# EAGLE board IGVC Controller v1.9 (EAGLE 6.4), part 1 of 2
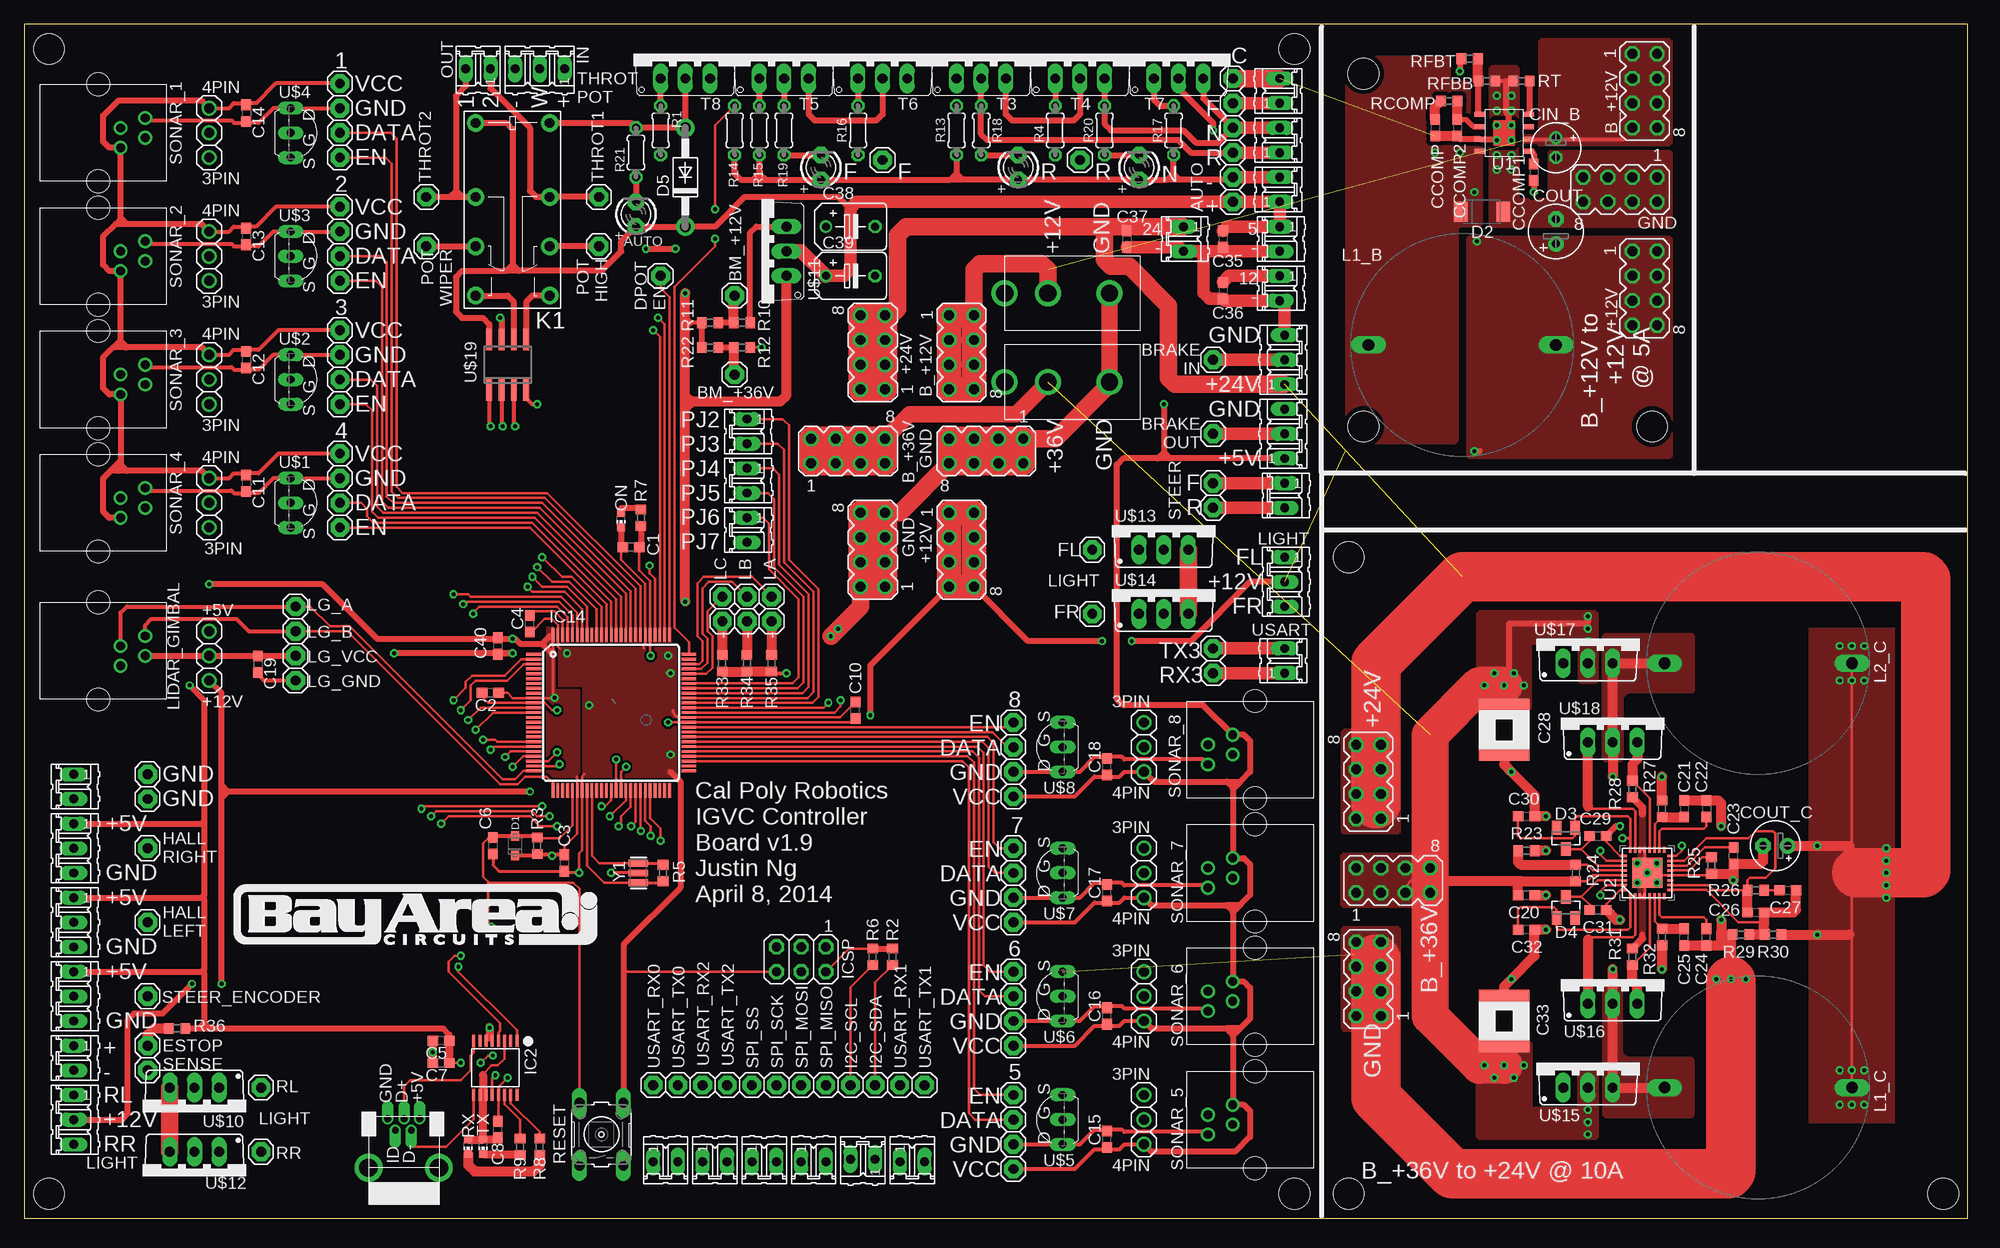
[diagram p7: board, top side]
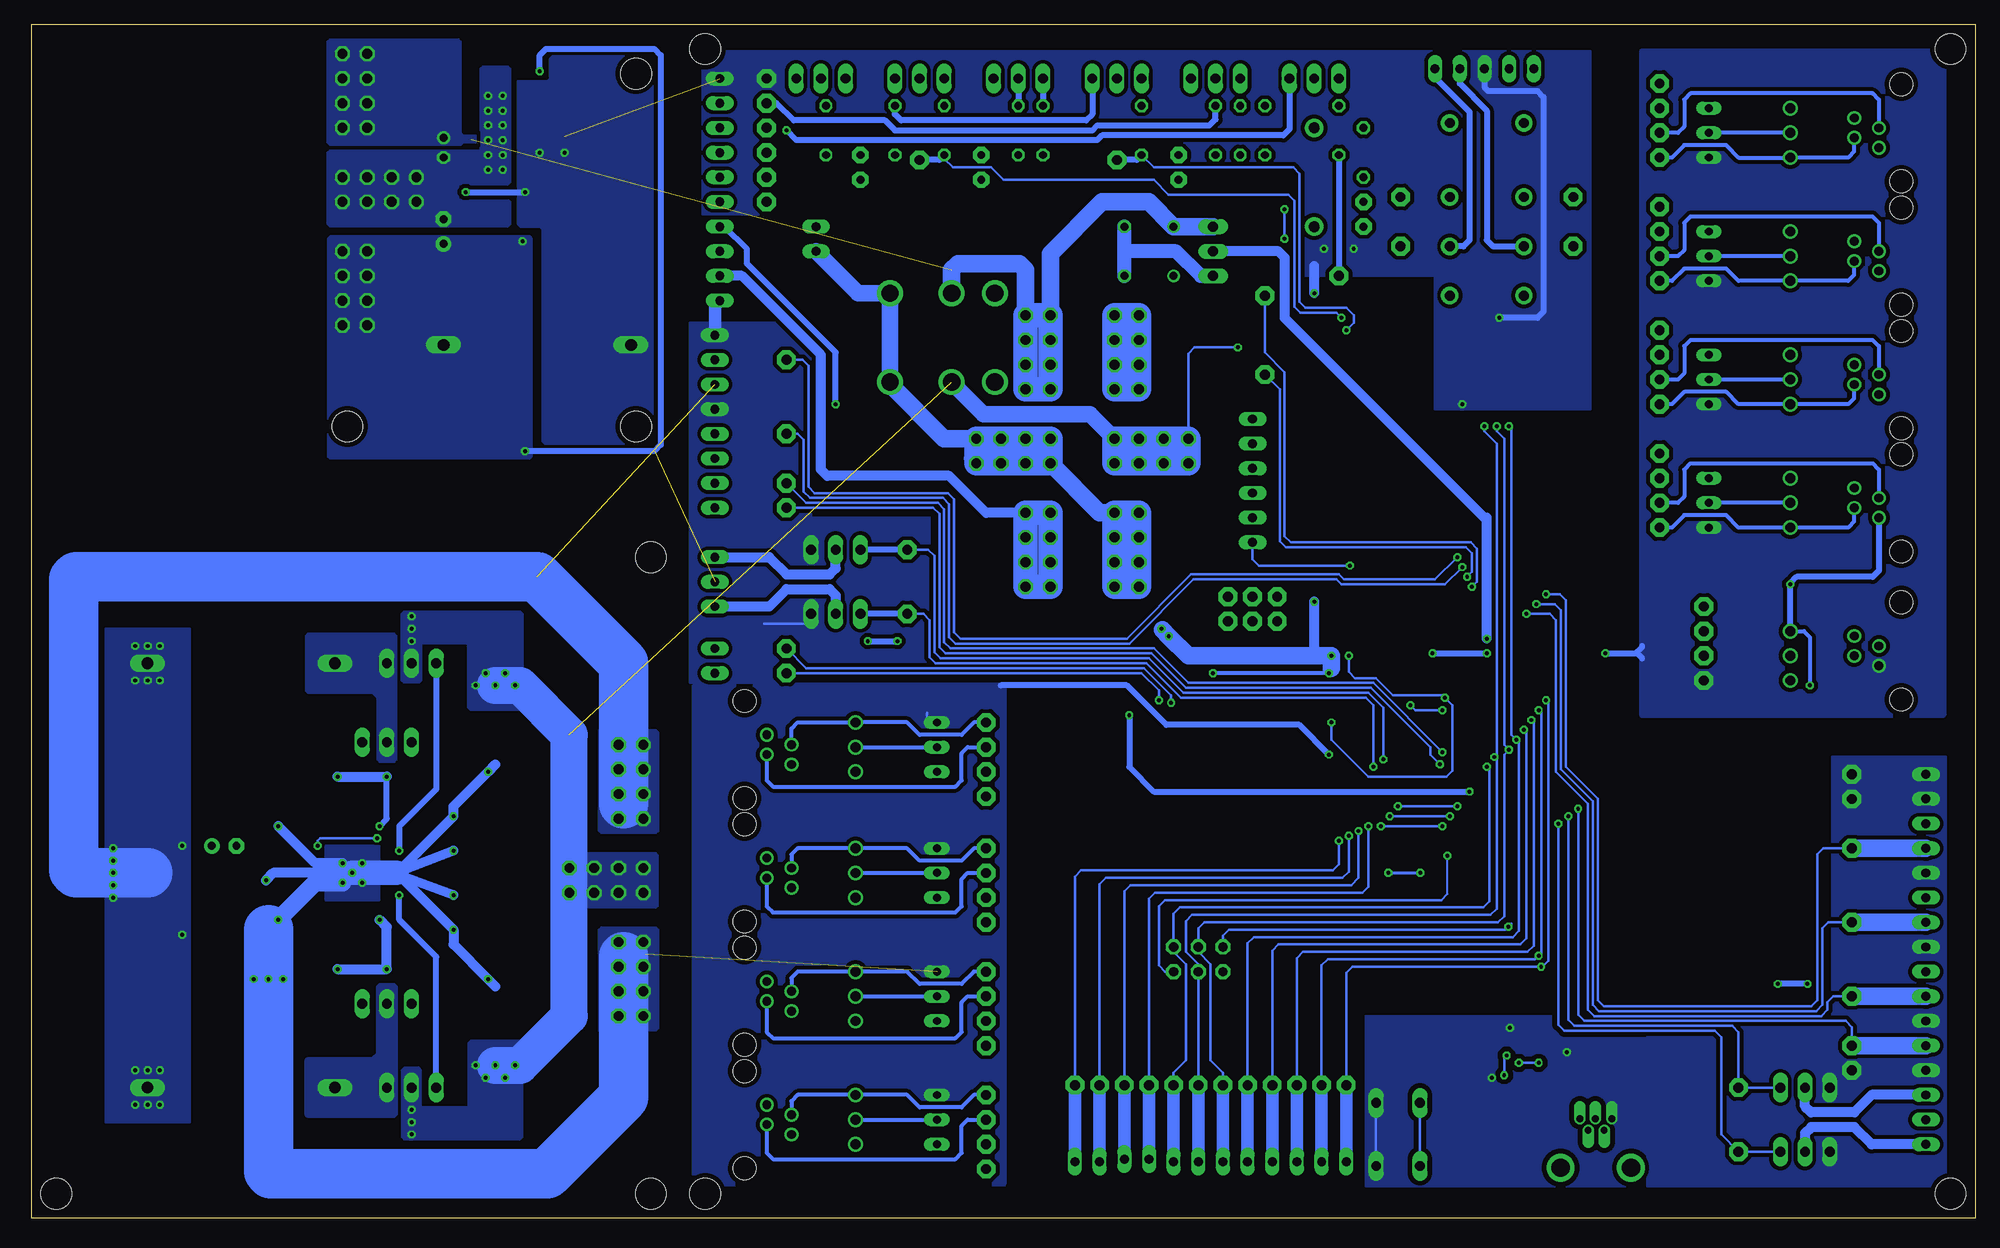
[diagram p8: board, bottom side, seen from below]

Size 200.15 x 122.94 mm. Coordinates in mm from the lower left corner, seen from the top.
Outline: 0,0 200.15,0 200.15,122.94 0,122.94 0,0
Copper layers (1*16): Top 0.035mm / dielectric 1.5mm / Bottom 0.035mm
Design rules "bayareacircuits *": minimum track width 8mil, minimum drill 15mil, track to track 8mil, track to pad 8mil, pad to pad 8mil, via to via 8mil, smd to smd 0mil, copper to edge 20mil, drill to drill 16mil, minimum pad ring 10mil, minimum via ring 8mil, stop-mask expansion 4mil, vias tented up to drill 0mil, thermal gap 10mil
Net classes: 0 default: width 0.203 mm, drill 0.406 mm, clearance 0.102 mm; 1 power: width 0.203 mm, drill 0.406 mm, clearance 0.203 mm; 2 gnd: width 0.203 mm, drill 0.406 mm, clearance 0.203 mm; 3 power usb: width 0.508 mm, drill 0.406 mm, clearance 0.203 mm
Holes 3.17 mm at 2.54,2.54 130.81,120.4 2.54,120.4 130.81,2.54 137.92,81.53 167.64,81.53 137.92,117.86 136.4,68.07 136.4,2.54 197.61,2.54

## Footprints (pad centres in the part's own frame; a part is rotated, then mirrored left to right if it is on the bottom)
02P = drill 0.914 long: 1 -1.27,0; 2 1.27,0
1X01 = drill 1.016 pad 1.93 octagon: 1 0,0
432550059 = drill 1.778: 1 -2.54,0; 2 3.81,0; 3 -6.985,0
03P = drill 0.914 long: 1 -2.54,0; 2 0,0; 3 2.54,0
C0603 = smd 1.1 x 1: 1 -0.85,0; 2 0.85,0
5750 = smd 1.2 x 5.2: P$1 -2.6,0; P$2 2.6,0
B45181B = drill 0.813: + -2.54,0 | drill 0.813 octagon: - 2.54,0
E2-5 = drill 0.813 pad 1.27: + -1.016,0 | drill 0.813 pad 1.27 octagon: - 1.016,0
E2,5-6 = drill 0.813 pad 1.6: + -1.27,0 | drill 0.813 pad 1.6 octagon: - 1.27,0
E2,5-5 = drill 0.813 pad 1.6: + -1.27,0 | drill 0.813 pad 1.6 octagon: - 1.27,0
SOD-323F = smd 1 x 0.8: A -1,0; C 1,0
SOD-128 = smd 1.4 x 2.1: A -2.2,0; C 2.2,0
SOT23 = smd 1 x 1.4: 1 -0.95,-1.1; 2 0.95,-1.1; 3 0,1.1
DO41-10 = drill 1.118 pad 1.93: A 5.08,0; C -5.08,0
SSOP-16-FTDI = smd 0.32 x 1.26: 1 -2.223,-2.779; 2 -1.588,-2.779; 3 -0.953,-2.779; 4 -0.318,-2.779; 5 0.317,-2.779; 6 0.952,-2.779; 7 1.587,-2.779; 8 2.222,-2.779; 9 2.222,2.779; 10 1.587,2.779; 11 0.952,2.779; 12 0.317,2.779; 13 -0.318,2.779; 14 -0.953,2.779; 15 -1.588,2.779; 16 -2.223,2.779
TQFP100 = smd 1.5 x 0.29: 1 -8,6; 2 -8,5.5; 3 -8,5; 4 -8,4.5; 5 -8,4; 6 -8,3.5; 7 -8,3; 8 -8,2.5; 9 -8,2; 10 -8,1.5; 11 -8,1; 12 -8,0.5; 13 -8,0; 14 -8,-0.5; 15 -8,-1; 16 -8,-1.5; 17 -8,-2; 18 -8,-2.5; 19 -8,-3; 20 -8,-3.5; 21 -8,-4; 22 -8,-4.5; 23 -8,-5; 24 -8,-5.5; 25 -8,-6; 51 8,-6; 52 8,-5.5; 53 8,-5; 54 8,-4.5; 55 8,-4; 56 8,-3.5; 57 8,-3; 58 8,-2.5; 59 8,-2; 60 8,-1.5; 61 8,-1; 62 8,-0.5; 63 8,0; 64 8,0.5; 65 8,1; 66 8,1.5; 67 8,2; 68 8,2.5; 69 8,3; 70 8,3.5; 71 8,4; 72 8,4.5; 73 8,5; 74 8,5.5; 75 8,6 | smd 0.29 x 1.5: 26 -6,-8; 27 -5.5,-8; 28 -5,-8; 29 -4.5,-8; 30 -4,-8; 31 -3.5,-8; 32 -3,-8; 33 -2.5,-8; 34 -2,-8; 35 -1.5,-8; 36 -1,-8; 37 -0.5,-8; 38 0,-8; 39 0.5,-8; 40 1,-8; 41 1.5,-8; 42 2,-8; 43 2.5,-8; 44 3,-8; 45 3.5,-8; 46 4,-8; 47 4.5,-8; 48 5,-8; 49 5.5,-8; 50 6,-8; 76 6,8; 77 5.5,8; 78 5,8; 79 4.5,8; 80 4,8; 81 3.5,8; 82 3,8; 83 2.5,8; 84 2,8; 85 1.5,8; 86 1,8; 87 0.5,8; 88 0,8; 89 -0.5,8; 90 -1,8; 91 -1.5,8; 92 -2,8; 93 -2.5,8; 94 -3,8; 95 -3.5,8; 96 -4,8; 97 -4.5,8; 98 -5,8; 99 -5.5,8; 100 -6,8
2X03 = drill 0.95 pad 1.55 octagon: 1 -2.54,-1.27; 2 -2.54,1.27; 3 0,-1.27; 4 0,1.27; 5 2.54,-1.27; 6 2.54,1.27
G5V-2 = drill 1 pad 1.8: 1 -8.89,-3.81; 4 -1.27,-3.81; 6 3.81,-3.81; 8 8.89,-3.81; 9 8.89,3.81; 11 3.81,3.81; 13 -1.27,3.81; 16 -8.89,3.81
TOROID = drill 1.2 long: P$1 -9.652,0; P$2 9.652,0
LED3MM = drill 0.813 pad 1.676 octagon: A -1.27,0; K 1.27,0
615004143821 = drill 0.9: 1 1.53,2.3; 2 0.51,4.84; 3 -0.51,2.3; 4 -1.53,4.84 | hole 2.36: -5,0; 5,0
1X03 = drill 1.016: 1 -2.54,0; 2 0,0; 3 2.54,0
CHIP-LED0603 = smd 0.8 x 0.8: A 0,-0.75; C 0,0.75
0204/5 = drill 0.813 octagon: 1 -2.54,0; 2 2.54,0
R0603 = smd 1 x 1.1: 1 -0.85,0; 2 0.85,0
B3F-10XX = drill 1.016 long: 1 -3.251,2.261; 2 3.251,2.261; 3 -3.251,-2.261; 4 3.251,-2.261
MA04-2 = drill 1.016 octagon: 1 -3.81,-1.27; 2 -3.81,1.27; 3 -1.27,-1.27; 4 -1.27,1.27; 5 1.27,-1.27; 6 1.27,1.27; 7 3.81,-1.27; 8 3.81,1.27
TO220V = drill 1.016 long: 1 -2.54,-2.54; 2 0,-2.54; 3 2.54,-2.54
R-PDSO-G8 = smd 1.1 x 0.51: BOOT -2.5,1.4; COMP 2.5,-1.13; EN -2.5,-1.13; FB 2.5,-2.4; GND 2.5,0.13; RT_CLK -2.5,-2.4; SW 2.5,1.4; VIN -2.5,0.13
SQA32A = smd 0.61 x 0.254: 1 -2.388,1.753; 2 -2.388,1.245; 3 -2.388,0.762; 4 -2.388,0.254; 5 -2.388,-0.254; 6 -2.388,-0.762; 7 -2.388,-1.245; 8 -2.388,-1.753; 17 2.388,-1.753; 18 2.388,-1.245; 19 2.388,-0.762; 20 2.388,-0.254; 21 2.388,0.254; 22 2.388,0.762; 23 2.388,1.245; 24 2.388,1.753 | smd 0.254 x 0.61: 9 -1.753,-2.388; 10 -1.245,-2.388; 11 -0.762,-2.388; 12 -0.254,-2.388; 13 0.254,-2.388; 14 0.762,-2.388; 15 1.245,-2.388; 16 1.753,-2.388; 25 1.753,2.388; 26 1.245,2.388; 27 0.762,2.388; 28 0.254,2.388; 29 -0.254,2.388; 30 -0.762,2.388; 31 -1.245,2.388; 32 -1.753,2.388 | smd 3.099 x 3.099: 33 0,0
TO92-DGS = drill 0.813 long: D -2.54,0; G 0,0; S 2.54,0
USB-MINI-B = drill 0.7 pad 0.813 offset: +5V 3.4,-1.85; D+ 3.4,-0.25; D- 2.2,-1; GND 3.4,1.45; ID 2.2,0.65 | drill 1.9: P$1 -1.65,-3.85; P$7 -1.65,3.4
TO220-GDS = drill 1.016 long: D 0,-2.54; G -2.54,-2.54; S 2.54,-2.54
SO8 = smd 0.6 x 2.2: 1 -1.905,-2.6; 2 -0.635,-2.6; 3 0.635,-2.6; 4 1.905,-2.6; 5 1.905,2.6; 6 0.635,2.6; 7 -0.635,2.6; 8 -1.905,2.6
RESONATOR = smd 0.7 x 2: 1 -1,0; 2 0,0; 3 1,0

## Placement (x,y rotation side)
+5V  [02P]  129.29,100.84 270 top
+12V  [02P]  129.29,95.76 270 top
+24V  [02P]  119.38,100.84 270 top
AM_TOGGLE  [02P]  129.29,105.92 90 top
AMTOG+  [1X01]  124.46,104.65 0 top
AMTOG-  [1X01]  124.46,107.19 0 top
B_+12V  432550059  [432550059]  107.95,95.25 0 top
B_+36V  432550059  [432550059]  107.95,86.11 0 top
BM_+12V  [1X01]  73.15,95 0 top
BM_+36V  [1X01]  73.15,86.87 0 top
BRAKE_IN  [1X01]  122.43,88.39 180 top
BRAKE_OUT  [1X01]  122.43,80.77 180 top
BRAKES_IN  [03P]  129.79,88.39 90 top
BRAKES_OUT  [03P]  129.79,80.77 90 top
C1  0.1uF  [C0603]  62.48,69.09 180 top
C2  0.1uF  [C0603]  48.01,54.1 180 top
C3  0.1uF  [C0603]  55.63,36.58 270 top
C4  0.1uF  [C0603]  52.07,61.21 90 top
C5  4.7uF  [C0603]  42.93,18.29 180 top
C6  22pF  [C0603]  48.26,38.35 270 top
C7  0.1uF  [C0603]  42.93,16 180 top
C8  0.1uF  [C0603]  48.77,9.14 90 top
C10  0.1uF  [C0603]  85.6,52.32 90 top
C11  0.1uF  [C0603]  22.86,75.69 270 top
C12  0.1uF  [C0603]  22.86,88.39 270 top
C13  0.1uF  [C0603]  22.86,101.09 270 top
C14  0.1uF  [C0603]  22.86,113.79 270 top
C15  0.1uF  [C0603]  111.51,8.13 90 top
C16  0.1uF  [C0603]  111.51,20.83 90 top
C17  0.1uF  [C0603]  111.51,33.53 90 top
C18  0.1uF  [C0603]  111.51,46.48 90 top
C19  0.1uF  [C0603]  24.05,57.05 270 top
C20  0.1uF,100V  [C0603]  154.69,33.27 0 top
C21  820pF,50V  [C0603]  170.94,42.16 270 top
C22  15nF,50V  [C0603]  173.23,42.16 270 top
C23  470nF,4V  [C0603]  176.02,37.34 90 top
C24  15nF,50V  [C0603]  173.23,28.96 90 top
C25  820pF,50V  [C0603]  170.94,28.96 90 top
C26  220pF,50V  [C0603]  178.31,31.5 0 top
C27  680pF,50V  [C0603]  181.61,33.78 0 top
C28  10uF,100V  [5750]  152.4,50.29 270 top
C29  100nF,10V  [C0603]  162.05,39.37 0 top
C30  470nF,10V  [C0603]  154.69,41.4 0 top
C31  100nF,10V  [C0603]  162.05,31.75 180 top
C32  470nF, 10V  [C0603]  154.69,29.72 180 top
C33  10uF,100V  [5750]  152.4,20.32 90 top
C35  0.1uF  [C0603]  123.44,100.84 270 top
C36  0.1uF  [C0603]  123.44,95.5 270 top
C37  0.1uF  [C0603]  113.54,100.84 270 top
C38  10uF  [B45181B]  85.09,102.11 0 top
C39  10uF  [B45181B]  85.09,97.03 0 top
C40  0.1uF  [C0603]  48.77,58.93 270 top
CCOMP  0.0036 uF  [C0603]  145.29,112.27 270 top
CCOMP1  0.100 uF  [C0603]  155.45,107.7 270 top
CCOMP2  47 pF  [C0603]  147.57,112.27 270 top
CIN_B  2.2 uF  [E2-5]  157.73,110.24 270 top
COUT  56.0 uF  [E2,5-6]  157.73,101.6 90 top
COUT_C  100uF,35V  [E2,5-5]  180.34,38.35 180 top
D1  [SOD-323F]  50.55,38.35 270 top
D2  [SOD-128]  150.11,103.63 180 top
D3  BAS70  [SOT23]  158.75,39.12 180 top
D4  BAS70  [SOT23]  158.75,32 0 top
D5  1N4004  [DO41-10]  68.07,107.19 90 top
DPOT_ENABLE  [1X01]  65.53,97.03 0 top
ESTOP_SENSE  [02P]  5.08,16.51 270 top
ESTOP_SENSE+  [1X01]  12.7,17.78 0 top
ESTOP_SENSE-  [1X01]  12.7,15.24 0 top
GEARSHIFT_1  [02P]  129.29,111 90 top
GEARSHIFT_2  [02P]  129.29,116.08 90 top
GEARSHIFT_F  [1X01]  88.39,108.97 180 top
GEARSHIFT_GND  [1X01]  12.7,43.18 0 top
GEARSHIFT_R  [1X01]  108.71,108.97 270 top
GND  [02P]  5.08,44.45 270 top
GND_A  [1X01]  76.96,61.47 270 top
GND_B  [1X01]  74.42,61.47 270 top
GND_C  [1X01]  71.88,61.47 270 top
GS_C  N  [1X01]  124.46,117.35 0 top
GS_F  F  [1X01]  124.46,114.81 180 top
GS_N  N  [1X01]  124.46,112.27 180 top
GS_R  R  [1X01]  124.46,109.73 180 top
HALL_1  [03P]  5.08,30.48 270 top
HALL_2  [03P]  5.08,38.1 270 top
HALL_LEFT  [1X01]  12.7,30.48 0 top
HALL_RIGHT  [1X01]  12.7,38.1 0 top
I2C  [02P]  86.36,6.1 180 top
I2C_SCL  [1X01]  85.09,13.72 90 top
I2C_SDA  [1X01]  87.63,13.72 90 top
IC2  IC_FT230X-SSOP-16  [SSOP-16-FTDI]  48.51,15.49 180 top
IC14  ATMEGA2560-16AU  [TQFP100]  60.45,52.07 0 top
ICSP  3x2M  [2X03]  80.01,26.67 180 top
K1  G5V-2  [G5V-2]  50.29,103.89 270 top
L1_B  15uH  [TOROID]  148.08,89.92 0 top
L1_C  15uH  [TOROID]  178.56,13.46 0 top
L2_C  15uH  [TOROID]  178.56,57.15 0 top
LA  [1X01]  76.96,64.01 90 top
LB  [1X01]  74.42,64.01 90 top
LC  [1X01]  71.88,64.01 90 top
LED1  BLUE  [LED3MM]  114.81,108.2 90 top
LED2  RED  [LED3MM]  102.36,108.2 90 top
LED3  GREEN  [LED3MM]  82.04,108.2 90 top
LED4  [LED3MM]  62.99,103.38 90 top
LG_A  [1X01]  27.94,62.99 0 top
LG_B  [1X01]  27.94,60.45 0 top
LG_GND  [1X01]  27.94,55.37 0 top
LG_VCC  [1X01]  27.94,57.91 0 top
LIDAR_GIMBAL  615004143821  [615004143821]  7.62,58.42 270 top
LIDAR_GIMBAL_PWRSEL  [1X03]  19.05,57.91 270 top
LIGHT_FL  [1X01]  109.98,68.83 180 top
LIGHT_FR  [1X01]  109.98,62.23 180 top
LIGHT_FRONT  [03P]  129.79,65.53 270 top
LIGHT_REAR  [03P]  5.08,10.16 270 top
LIGHT_RL  [1X01]  24.38,13.46 0 top
LIGHT_RR  [1X01]  24.38,6.86 0 top
MISC_1  [02P]  74.42,81.03 270 top
MISC_2  [02P]  74.42,75.95 270 top
MISC_3  [02P]  74.42,70.87 270 top
ON  GREEN  [CHIP-LED0603]  61.47,71.88 180 top
POT_GND  POT_GND  [1X01]  12.7,45.72 0 top
POT_HIGH  [1X01]  59.18,100.08 90 top
POT_WIPER  [1X01]  41.4,100.08 90 top
R1  150  [0204/5]  65.53,112.01 270 top
R2  10K  [R0603]  89.41,26.92 270 top
R3  10K  [R0603]  52.83,38.35 270 top
R4  150  [0204/5]  106.17,112.01 90 top
R5  1M  [R0603]  65.79,35.56 270 top
R6  10K  [R0603]  87.38,26.92 270 top
R7  1K  [R0603]  63.5,72.14 270 top
R8  470  [R0603]  53.09,7.37 90 top
R9  470  [R0603]  51.05,7.37 90 top
R10  10K  [R0603]  73.91,92.2 0 top
R11  5.1K  [R0603]  70.61,92.2 0 top
R12  36K  [R0603]  73.91,89.66 0 top
R13  150  [0204/5]  96.01,112.01 90 top
R14  10K  [0204/5]  73.15,112.01 90 top
R15  150  [0204/5]  75.69,112.01 90 top
R16  150  [0204/5]  85.85,112.01 90 top
R17  150  [0204/5]  118.36,112.01 90 top
R18  1K  [0204/5]  98.55,112.01 270 top
R19  1k  [0204/5]  78.23,112.01 270 top
R20  1K  [0204/5]  111.25,112.01 90 top
R21  1K  [0204/5]  62.99,109.73 90 top
R22  4.7K  [R0603]  70.61,89.66 0 top
R23  3.01K  [R0603]  154.69,37.85 180 top
R24  54.9K  [R0603]  159.77,35.56 270 top
R25  14.3K  [R0603]  173.74,36.32 90 top
R26  75K  [R0603]  178.31,33.78 0 top
R27  121K  [R0603]  168.66,42.16 270 top
R28  0.01,0.5W  [R0603]  165.61,44.2 270 top
R29  1.2K,0.1W  [R0603]  176.78,29.21 0 top
R30  34.8K  [R0603]  180.09,29.21 0 top
R31  0.01,0.5W  [R0603]  165.61,26.92 270 top
R32  121K  [R0603]  168.66,28.96 90 top
R33  330  [R0603]  71.88,57.15 90 top
R34  330  [R0603]  74.42,57.15 90 top
R35  330  [R0603]  76.96,57.15 90 top
R36  1K  [R0603]  15.75,19.56 0 top
RCOMP  36.5 KOhm  [R0603]  146.74,115.04 0 top
RESET  [B3F-10XX]  59.44,8.64 90 top
RFBB  10.2 KOhm  [R0603]  150.62,117.09 180 top
RFBT  143 KOhm  [R0603]  148.84,119.38 180 top
RT  205 KOhm  [R0603]  154.18,117.09 0 top
RX  YELLOW  [CHIP-LED0603]  45.72,7.37 180 top
SONAR_1  615004143821  [615004143821]  7.62,111.76 270 top
SONAR_1_DATA  [1X01]  32.51,111.76 0 top
SONAR_1_EN  [1X01]  32.51,109.22 0 top
SONAR_1_ENSEL  [1X03]  19.05,111.76 90 top
SONAR_1_GND  [1X01]  32.51,114.3 0 top
SONAR_1_VCC  [1X01]  32.51,116.84 0 top
SONAR_2  615004143821  [615004143821]  7.62,99.06 270 top
SONAR_2_DATA  [1X01]  32.51,99.06 0 top
SONAR_2_EN  [1X01]  32.51,96.52 0 top
SONAR_2_ENSEL  [1X03]  19.05,86.36 90 top
SONAR_2_GND  [1X01]  32.51,101.6 0 top
SONAR_2_VCC  [1X01]  32.51,104.14 0 top
SONAR_3  615004143821  [615004143821]  7.62,86.36 270 top
SONAR_3_DATA  [1X01]  32.51,86.36 0 top
SONAR_3_EN  [1X01]  32.51,83.82 0 top
SONAR_3_ENSEL  [1X03]  19.05,99.06 90 top
SONAR_3_GND  [1X01]  32.51,88.9 0 top
SONAR_3_VCC  [1X01]  32.51,91.44 0 top
SONAR_4  615004143821  [615004143821]  7.62,73.66 270 top
SONAR_4_DATA  [1X01]  32.51,73.66 0 top
SONAR_4_EN  [1X01]  32.51,71.12 0 top
SONAR_4_GND  [1X01]  32.51,76.2 0 top
SONAR_4_VCC  [1X01]  32.51,78.74 0 top
SONAR_5  615004143821  [615004143821]  126.75,10.16 90 top
SONAR_5_DATA  [1X01]  101.85,10.16 180 top
SONAR_5_EN  [1X01]  101.85,12.7 180 top
SONAR_5_ENSEL  [1X03]  115.32,10.16 270 top
SONAR_5_GND  [1X01]  101.85,7.62 180 top
SONAR_5_VCC  [1X01]  101.85,5.08 180 top
SONAR_6  615004143821  [615004143821]  126.75,22.86 90 top
SONAR_6_DATA  [1X01]  101.85,22.86 180 top
SONAR_6_EN  [1X01]  101.85,25.4 180 top
SONAR_6_ENSEL  [1X03]  115.32,22.86 270 top
SONAR_6_GND  [1X01]  101.85,20.32 180 top
SONAR_6_VCC  [1X01]  101.85,17.78 180 top
SONAR_7  615004143821  [615004143821]  126.75,35.56 90 top
SONAR_7_DATA1  [1X01]  101.85,35.56 0 top
SONAR_7_EN1  [1X01]  101.85,38.1 180 top
SONAR_7_ENSEL  [1X03]  115.32,35.56 270 top
SONAR_7_GND  [1X01]  101.85,33.02 180 top
SONAR_7_VCC  [1X01]  101.85,30.48 180 top
SONAR_8  615004143821  [615004143821]  126.75,48.26 90 top
SONAR_8_DATA1  [1X01]  101.85,48.51 0 top
SONAR_8_EN1  [1X01]  101.85,51.05 180 top
SONAR_8_ENSEL  [1X03]  115.32,48.51 270 top
SONAR_8_GND  [1X01]  101.85,45.97 180 top
SONAR_8_VCC  [1X01]  101.85,43.43 180 top
SONAR_B_ENSEL  [1X03]  19.05,73.66 90 top
SPI_1  [02P]  76.2,5.84 0 top
SPI_2  [02P]  81.28,5.84 0 top
SPI_MISO  [1X01]  82.55,13.72 90 top
SPI_MOSI  [1X01]  80.01,13.72 90 top
SPI_SCK  [1X01]  77.47,13.72 90 top
SPI_SS  [1X01]  74.93,13.72 90 top
STEER_ENCODER  [1X01]  12.7,22.86 0 top
STEER_MOTOR  [02P]  129.79,74.42 270 top
STEER_MOTOR_F  [1X01]  122.43,75.69 180 top
STEER_MOTOR_R  [1X01]  122.43,73.15 180 top
STEER_SENSE  [03P]  5.08,22.86 270 top
SV1  GND  [MA04-2]  99.06,78.99 180 top
SV2  GND  [MA04-2]  164.34,105.92 180 top
SV3  B_+12V  [MA04-2]  96.52,89.15 270 top
SV4  B_+12V  [MA04-2]  166.88,116.08 270 top
SV5  +12V  [MA04-2]  96.52,68.83 270 top
SV6  +12V  [MA04-2]  166.88,95.76 270 top
SV7  GND  [MA04-2]  87.38,68.83 90 top
SV8  GND  [MA04-2]  138.43,24.64 90 top
SV9  B_+36V  [MA04-2]  84.84,78.99 0 top
SV10  B_+36V  [MA04-2]  140.97,34.8 0 top
SV11  +24V  [MA04-2]  87.38,89.15 90 top
SV12  +24V  [MA04-2]  138.43,44.96 90 top
T3  TIP122TO220V  [TO220V]  98.55,119.89 0 top
T4  TIP122TO220V  [TO220V]  108.71,119.89 0 top
T5  TIP122TO220V  [TO220V]  78.23,119.89 0 top
T6  TIP122TO220V  [TO220V]  88.39,119.89 0 top
T7  TIP122TO220V  [TO220V]  118.87,119.89 0 top
T8  TIP122TO220V  [TO220V]  68.07,119.89 0 top
THROTPOT_IN  [03P]  53.09,118.36 180 top
THROTPOT_OUT  [02P]  46.74,118.36 180 top
THROTTLE1  [1X01]  59.18,105.16 90 top
THROTTLE2  [1X01]  41.4,105.16 90 top
TX  YELLOW  [CHIP-LED0603]  47.24,7.37 180 top
U1  TPS54540  [R-PDSO-G8]  152.4,111.25 180 top
U2  LM25119_RTV_32  [SQA32A]  167.13,35.56 90 top
U$1  BS270  [TO92-DGS]  27.43,73.66 270 top
U$2  BS270  [TO92-DGS]  27.43,86.36 270 top
U$3  BS270  [TO92-DGS]  27.43,99.06 270 top
U$4  BS270  [TO92-DGS]  27.43,111.76 270 top
U$5  BS270  [TO92-DGS]  106.93,10.16 90 top
U$6  BS270  [TO92-DGS]  106.93,22.86 90 top
U$7  BS270  [TO92-DGS]  106.93,35.56 90 top
U$8  BS270  [TO92-DGS]  106.93,48.51 90 top
U$9  USB-MINI-B  [USB-MINI-B]  38.86,6.86 90 top
U$10  NTD3055L104  [TO220-GDS]  17.53,10.92 180 top
U$11  LM1084  [TO220V]  75.95,99.57 90 top
U$12  NTD3055L104  [TO220-GDS]  17.53,4.32 180 top
U$13  NTD3055L104  [TO220-GDS]  117.35,71.37 0 top
U$14  NTD3055L104  [TO220-GDS]  117.35,64.77 0 top
U$15  NTD3055L104  [TO220-GDS]  161.04,16 0 top
U$16  NTD3055L104  [TO220-GDS]  163.58,24.64 0 top
U$17  NTD3055L104  [TO220-GDS]  161.04,59.69 0 top
U$18  NTD3055L104  [TO220-GDS]  163.58,51.56 0 top
U$19  MCP4131-502E  [SO8]  49.78,87.88 0 top
USART0  [02P]  66.04,5.84 0 top
USART1  [02P]  91.44,5.84 0 top
USART2  [02P]  71.12,5.84 0 top
USART3  [02P]  129.79,57.4 90 top
USART_RX0  [1X01]  64.77,13.72 90 top
USART_RX1  [1X01]  90.17,13.72 90 top
USART_RX2  [1X01]  69.85,13.72 0 top
USART_RX3  [1X01]  122.43,56.13 180 top
USART_TX0  [1X01]  67.31,13.72 90 top
USART_TX1  [1X01]  92.71,13.72 90 top
USART_TX2  [1X01]  72.39,13.72 0 top
USART_TX3  [1X01]  122.43,58.67 180 top
Y1  CSTCE16M0V53-R0 16MHZ  [RESONATOR]  63.25,35.56 90 top